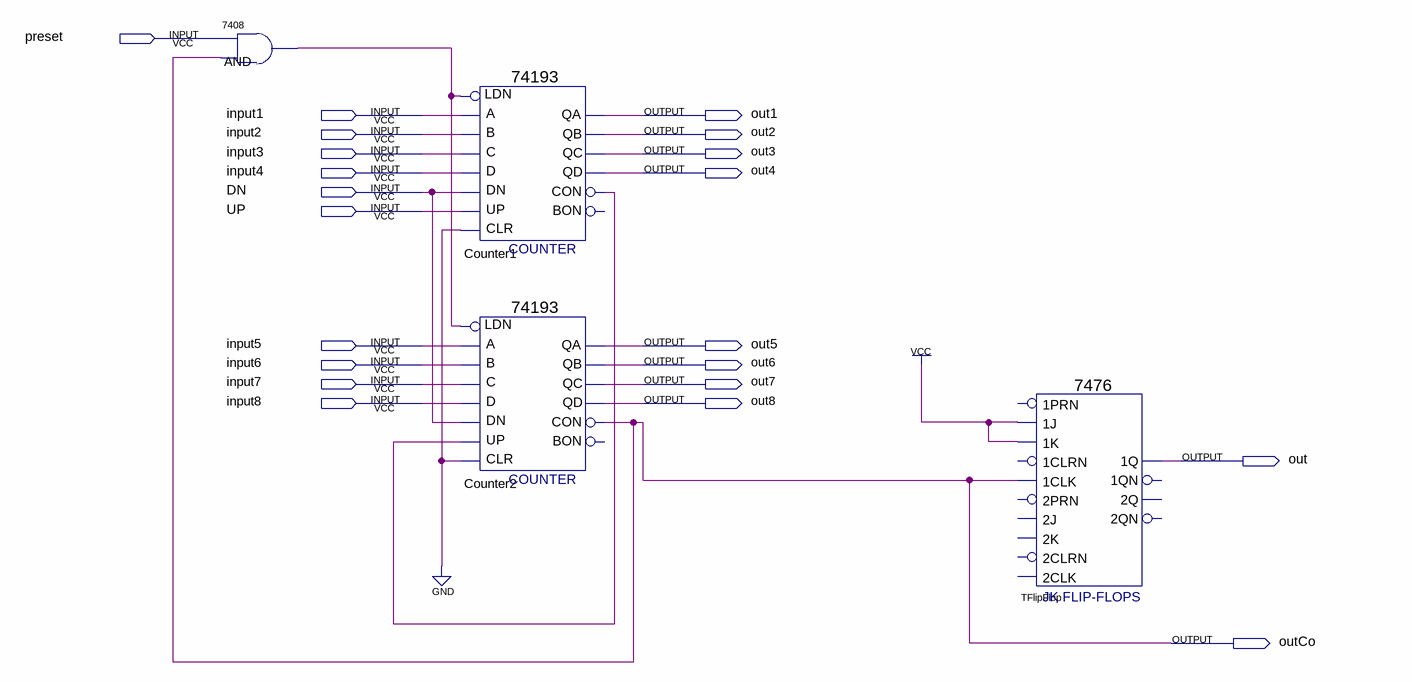
[diagram p0: schematic sheet]
// Quartus schematic DividerPart2_3.bdf as structural Verilog: 4 symbols, 21 pins
module DividerPart2_3 (
  input  preset,
  input  input1,
  input  input2,
  input  input3,
  input  input4,
  input  DN,
  input  UP,
  input  input5,
  input  input6,
  input  input7,
  input  input8,
  output out1,
  output out2,
  output out3,
  output out4,
  output out5,
  output out6,
  output out7,
  output out8,
  output out,
  output outCo
);

  wire AND_1, Counter1_con;

  \7408  AND (.\3 (outCo), .\2 (preset), .\1 (AND_1));
  \74193  Counter1 (
    .D(input4), .C(input3), .B(input2), .A(input1), .CLR(1'b0), .UP(UP), .DN(DN), .LDN(AND_1), .QB(out2),
    .QA(out1), .CON(Counter1_con), .QD(out4), .QC(out3));  // open: BON
  \74193  Counter2 (
    .D(input8), .C(input7), .B(input6), .A(input5), .CLR(1'b0), .UP(Counter1_con), .DN(DN), .LDN(AND_1),
    .QB(out6), .QA(out5), .CON(outCo), .QD(out8), .QC(out7));  // open: BON
  \7476  TFlipFlop (
    .\1J (1'b1), .\1K (1'b1), .\1CLK (outCo), .\1Q (out));  // open: 1PRN, 2PRN, 2J, 1CLRN, 2K, 2CLRN, 2CLK, 2QN, 2Q, 1QN
endmodule
